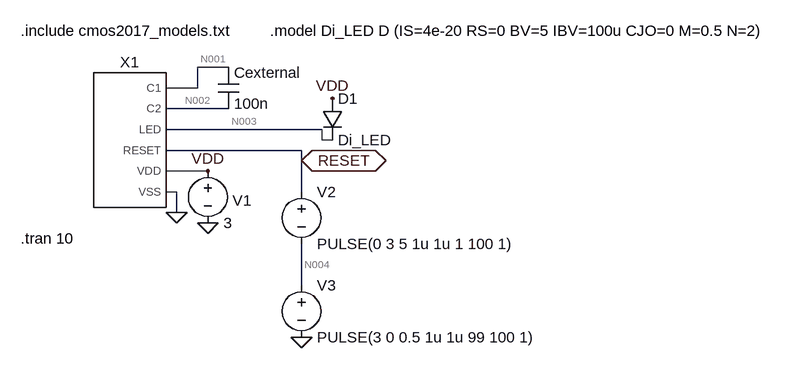
[diagram p0: schematic top.asc]
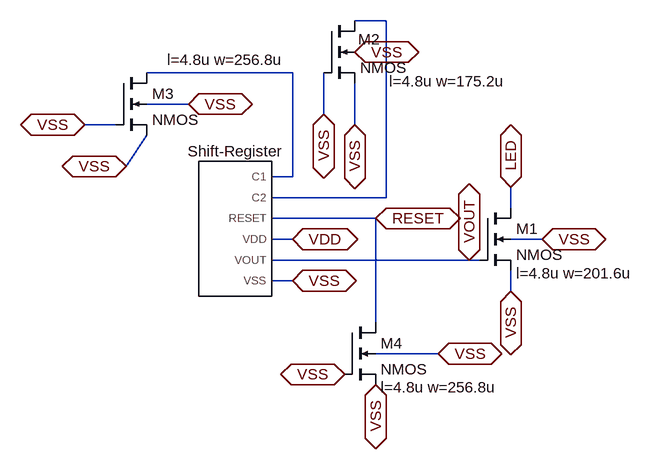
[diagram p1: sub-circuit output_driver.asc]
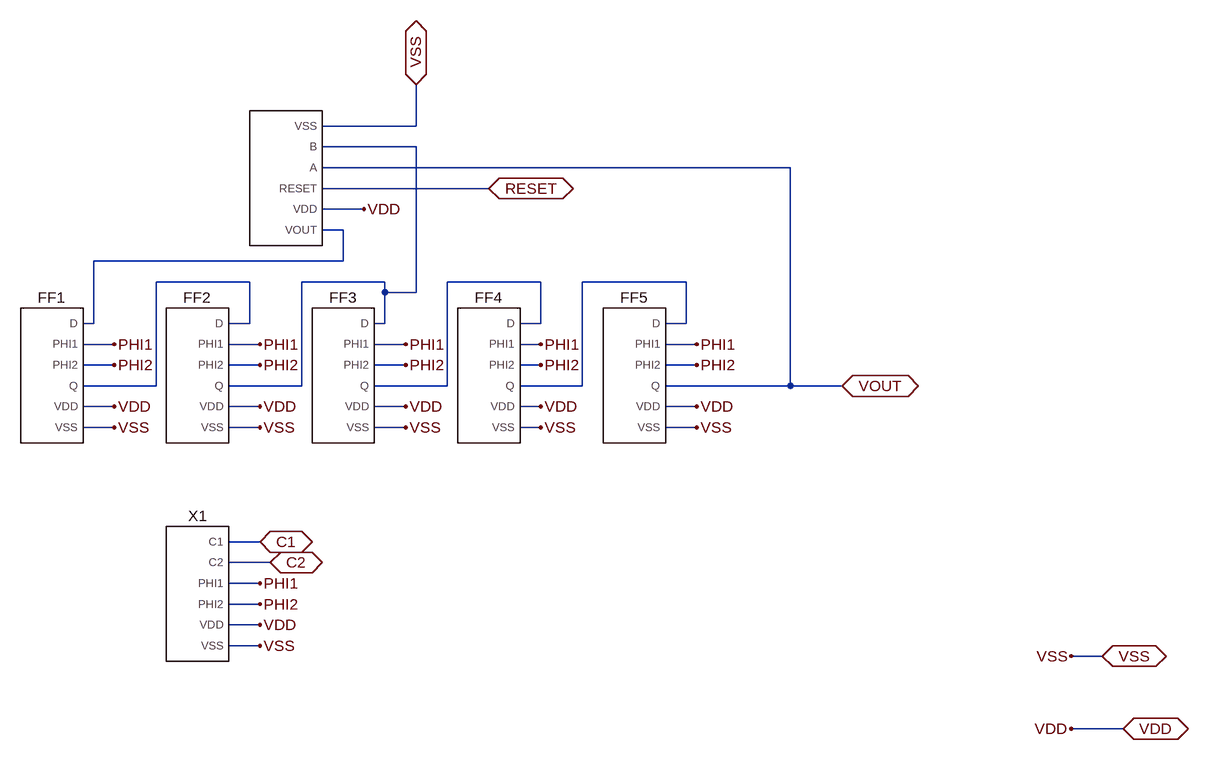
[diagram p2: sub-circuit shift_register.asc]
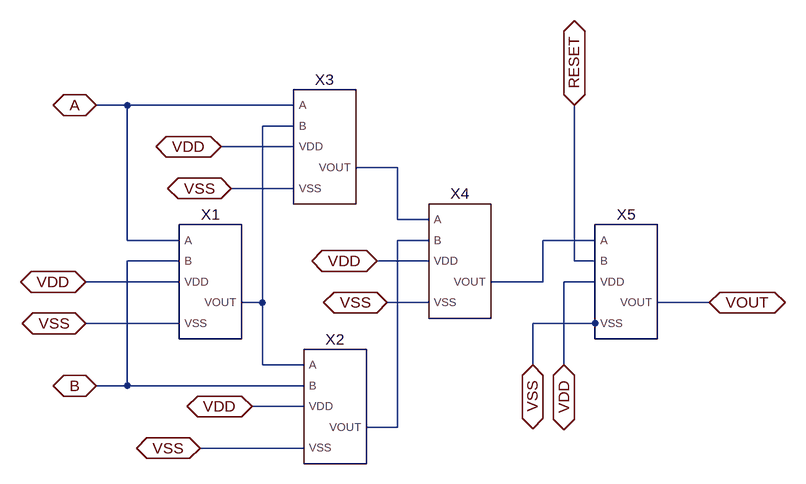
[diagram p3: sub-circuit xnor_reset.asc]
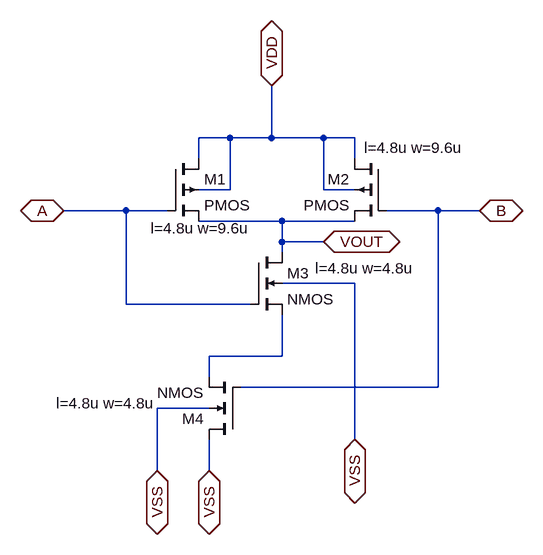
[diagram p4: sub-circuit na_nd.asc]
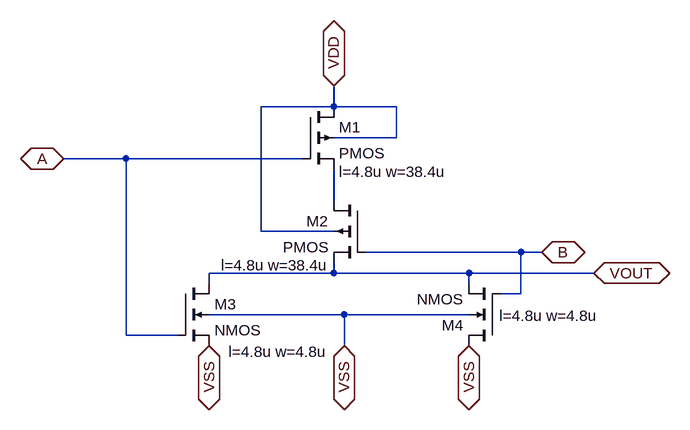
[diagram p5: sub-circuit n_or.asc]
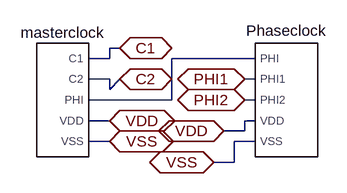
[diagram p6: sub-circuit mainclock.asc]
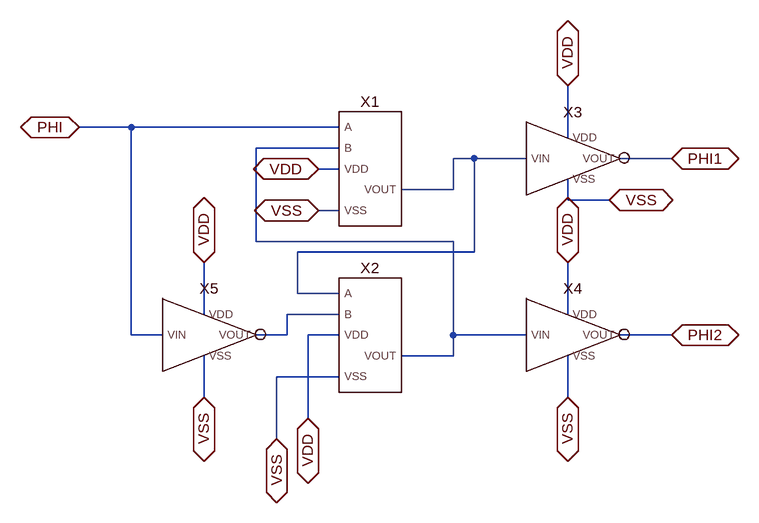
[diagram p7: sub-circuit phaseclock.asc]
top.asc, the LTspice schematic file:
Version 4
SHEET 1 1212 680
WIRE 272 64 224 64
WIRE 224 96 224 64
WIRE 224 96 176 96
WIRE 272 128 176 128
WIRE 416 160 176 160
WIRE 416 176 416 160
WIRE 432 176 416 176
WIRE 384 192 176 192
WIRE 384 208 384 192
WIRE 240 224 176 224
WIRE 192 256 176 256
WIRE 384 256 384 208
WIRE 192 288 192 256
WIRE 384 400 384 336
FLAG 192 288 0
FLAG 240 304 0
FLAG 240 224 VDD
FLAG 432 112 VDD
FLAG 384 480 0
FLAG 384 208 RESET
IOPIN 384 208 BiDir
SYMBOL output_driver 112 176 R0
SYMATTR InstName X1
SYMBOL cap 256 64 R0
SYMATTR InstName Cexternal
SYMATTR Value 100n
SYMBOL diode 416 112 R0
SYMATTR InstName D1
SYMATTR Value Di_LED
SYMBOL voltage 240 208 R0
WINDOW 0 38 61 Left 2
WINDOW 123 0 0 Left 2
WINDOW 39 0 0 Left 2
SYMATTR InstName V1
SYMATTR Value 3
SYMBOL voltage 384 240 R0
WINDOW 123 0 0 Left 2
WINDOW 39 0 0 Left 2
SYMATTR InstName V2
SYMATTR Value PULSE(0 3 5 1u 1u 1 100 1)
SYMBOL voltage 384 384 R0
WINDOW 123 0 0 Left 2
WINDOW 39 0 0 Left 2
SYMATTR InstName V3
SYMATTR Value PULSE(3 0 0.5 1u 1u 99 100 1)
TEXT 336 8 Left 2 !.model Di_LED D (IS=4e-20 RS=0 BV=5 IBV=100u CJO=0 M=0.5 N=2)
TEXT -48 8 Left 2 !.include cmos2017_models.txt
TEXT -48 328 Left 2 !.tran 10

output_driver.asc, the sub-circuit schematic file:
Version 4
SHEET 1 880 680
WIRE 352 -160 304 -160
WIRE 208 -80 -16 -80
WIRE 48 -32 -16 -32
WIRE 256 -16 256 -80
WIRE -64 0 -112 0
WIRE 304 0 304 -64
WIRE -48 64 -16 16
WIRE 208 80 208 -80
WIRE 208 80 176 80
WIRE 352 112 352 -160
WIRE 352 112 176 112
WIRE 544 128 544 96
WIRE 336 144 176 144
WIRE 208 176 176 176
WIRE 592 176 544 176
WIRE 480 208 176 208
WIRE 496 208 480 208
WIRE 208 240 176 240
WIRE 544 256 544 224
WIRE 336 304 336 144
WIRE 432 352 336 352
FLAG 336 144 RESET
IOPIN 336 144 BiDir
FLAG 208 176 VDD
IOPIN 208 176 BiDir
FLAG 208 240 VSS
IOPIN 208 240 BiDir
FLAG 544 96 LED
IOPIN 544 96 BiDir
FLAG 544 256 VSS
IOPIN 544 256 BiDir
FLAG 592 176 VSS
IOPIN 592 176 BiDir
FLAG 480 208 VOUT
IOPIN 480 208 BiDir
FLAG -48 64 VSS
IOPIN -48 64 BiDir
FLAG 48 -32 VSS
IOPIN 48 -32 BiDir
FLAG -112 0 VSS
IOPIN -112 0 BiDir
FLAG 304 0 VSS
IOPIN 304 0 BiDir
FLAG 256 -16 VSS
IOPIN 256 -16 BiDir
FLAG 304 -112 VSS
IOPIN 304 -112 BiDir
FLAG 288 384 VSS
IOPIN 288 384 BiDir
FLAG 336 400 VSS
IOPIN 336 400 BiDir
FLAG 432 352 VSS
IOPIN 432 352 BiDir
SYMBOL shift_register 112 160 R0
SYMATTR InstName Shift-Register
SYMBOL nmos4 496 128 R0
WINDOW 123 56 100 Left 2
SYMATTR InstName M1
SYMATTR Value2 l=4.8u w=201.6u
SYMBOL nmos4 256 -160 R0
WINDOW 0 53 28 Left 2
WINDOW 123 101 93 Left 2
SYMATTR InstName M2
SYMATTR Value2 l=4.8u w=175.2u
SYMBOL nmos4 -64 -80 R0
WINDOW 123 79 -20 Left 2
SYMATTR InstName M3
SYMATTR Value2 l=4.8u w=256.8u
SYMBOL nmos4 288 304 R0
WINDOW 123 56 100 Left 2
SYMATTR InstName M4
SYMATTR Value2 l=4.8u w=256.8u

shift_register.asc, the sub-circuit schematic file:
Version 4
SHEET 1 1708 832
WIRE 416 -272 416 -336
WIRE 416 -272 272 -272
WIRE 416 -240 272 -240
WIRE 992 -208 272 -208
WIRE 528 -176 272 -176
WIRE 336 -144 272 -144
WIRE 304 -112 272 -112
WIRE 304 -64 304 -112
WIRE 304 -64 -80 -64
WIRE 160 -32 16 -32
WIRE 368 -32 240 -32
WIRE 608 -32 464 -32
WIRE 832 -32 672 -32
WIRE 368 -16 368 -32
WIRE 416 -16 416 -240
WIRE 416 -16 368 -16
WIRE -80 32 -80 -64
WIRE -80 32 -96 32
WIRE 160 32 160 -32
WIRE 160 32 128 32
WIRE 368 32 368 -16
WIRE 368 32 352 32
WIRE 608 32 608 -32
WIRE 608 32 576 32
WIRE 832 32 832 -32
WIRE 832 32 800 32
WIRE -48 64 -96 64
WIRE 176 64 128 64
WIRE 400 64 352 64
WIRE 608 64 576 64
WIRE 848 64 800 64
WIRE -48 96 -96 96
WIRE 176 96 128 96
WIRE 400 96 352 96
WIRE 608 96 576 96
WIRE 848 96 800 96
WIRE 16 128 16 -32
WIRE 16 128 -96 128
WIRE 240 128 240 -32
WIRE 240 128 128 128
WIRE 464 128 464 -32
WIRE 464 128 352 128
WIRE 672 128 672 -32
WIRE 672 128 576 128
WIRE 992 128 992 -208
WIRE 992 128 800 128
WIRE 1072 128 992 128
WIRE -48 160 -96 160
WIRE 176 160 128 160
WIRE 400 160 352 160
WIRE 608 160 576 160
WIRE 848 160 800 160
WIRE -48 192 -96 192
WIRE 176 192 128 192
WIRE 400 192 352 192
WIRE 608 192 576 192
WIRE 848 192 800 192
WIRE 176 368 128 368
WIRE 192 400 128 400
WIRE 176 432 128 432
WIRE 176 464 128 464
WIRE 176 496 128 496
WIRE 176 528 128 528
WIRE 1472 544 1424 544
WIRE 1504 656 1424 656
FLAG -48 64 PHI1
FLAG 176 64 PHI1
FLAG 400 64 PHI1
FLAG 608 64 PHI1
FLAG 848 64 PHI1
FLAG 176 432 PHI1
FLAG -48 96 PHI2
FLAG 176 96 PHI2
FLAG 400 96 PHI2
FLAG 608 96 PHI2
FLAG 848 96 PHI2
FLAG 176 464 PHI2
FLAG -48 192 VSS
FLAG 176 192 VSS
FLAG 400 192 VSS
FLAG 608 192 VSS
FLAG 848 192 VSS
FLAG 176 528 VSS
FLAG -48 160 VDD
FLAG 176 160 VDD
FLAG 400 160 VDD
FLAG 608 160 VDD
FLAG 848 160 VDD
FLAG 176 496 VDD
FLAG 1504 656 VDD
IOPIN 1504 656 BiDir
FLAG 1472 544 VSS
IOPIN 1472 544 BiDir
FLAG 336 -144 VDD
FLAG 528 -176 RESET
IOPIN 528 -176 BiDir
FLAG 1072 128 VOUT
IOPIN 1072 128 BiDir
FLAG 416 -336 VSS
IOPIN 416 -336 BiDir
FLAG 1424 656 VDD
FLAG 1424 544 VSS
FLAG 176 368 C1
IOPIN 176 368 BiDir
FLAG 192 400 C2
IOPIN 192 400 BiDir
SYMBOL XNOR_reset 208 -192 R0
WINDOW 0 8 -115 Invisible 2
SYMATTR InstName XNOR
SYMBOL mainclock 80 448 R0
SYMATTR InstName X1
SYMBOL DFlipFlop -144 112 R0
SYMATTR InstName FF1
SYMBOL DFlipFlop 80 112 R0
SYMATTR InstName FF2
SYMBOL DFlipFlop 304 112 R0
SYMATTR InstName FF3
SYMBOL DFlipFlop 528 112 R0
SYMATTR InstName FF4
SYMBOL DFlipFlop 752 112 R0
SYMATTR InstName FF5

xnor_reset.asc, the sub-circuit schematic file:
Version 4
SHEET 1 880 680
WIRE -208 -224 -256 -224
WIRE 48 -224 -208 -224
WIRE 48 -192 0 -192
WIRE 48 -160 -64 -160
WIRE 208 -128 144 -128
WIRE 48 -96 -48 -96
WIRE 208 -48 208 -128
WIRE 256 -48 208 -48
WIRE -208 -16 -208 -224
WIRE -128 -16 -208 -16
WIRE 256 -16 208 -16
WIRE 512 -16 432 -16
WIRE -128 16 -208 16
WIRE 256 16 176 16
WIRE 480 16 480 -224
WIRE 512 16 480 16
WIRE -128 48 -272 48
WIRE 432 48 432 -16
WIRE 432 48 352 48
WIRE 512 48 464 48
WIRE 0 80 0 -192
WIRE 0 80 -32 80
WIRE 256 80 192 80
WIRE 688 80 608 80
WIRE -128 112 -272 112
WIRE 512 112 416 112
WIRE 512 128 512 112
WIRE 0 176 0 80
WIRE 64 176 0 176
WIRE 416 176 416 112
WIRE 464 176 464 48
WIRE -208 208 -208 16
WIRE -208 208 -256 208
WIRE 64 208 -208 208
WIRE 64 240 -16 240
WIRE 208 272 208 -16
WIRE 208 272 160 272
WIRE 64 304 -96 304
FLAG -256 -224 A
IOPIN -256 -224 BiDir
FLAG -256 208 B
IOPIN -256 208 BiDir
FLAG -272 112 VSS
IOPIN -272 112 BiDir
FLAG -272 48 VDD
IOPIN -272 48 BiDir
FLAG -64 -160 VDD
IOPIN -64 -160 BiDir
FLAG -48 -96 VSS
IOPIN -48 -96 BiDir
FLAG -96 304 VSS
IOPIN -96 304 BiDir
FLAG -16 240 VDD
IOPIN -16 240 BiDir
FLAG 688 80 VOUT
IOPIN 688 80 BiDir
FLAG 464 176 VDD
IOPIN 464 176 BiDir
FLAG 416 176 VSS
IOPIN 416 176 BiDir
FLAG 480 -224 RESET
IOPIN 480 -224 BiDir
FLAG 176 16 VDD
IOPIN 176 16 BiDir
FLAG 192 80 VSS
IOPIN 192 80 BiDir
SYMBOL NA_ND -80 48 M0
SYMATTR InstName X1
SYMBOL NA_ND 112 240 M0
SYMATTR InstName X2
SYMBOL NA_ND 96 -160 M0
SYMATTR InstName X3
SYMBOL NA_ND 304 16 M0
SYMATTR InstName X4
SYMBOL N_OR 560 48 R0
SYMATTR InstName X5

na_nd.asc, the sub-circuit schematic file:
Version 4
SHEET 1 880 680
WIRE 96 16 48 16
WIRE 160 16 160 -64
WIRE 160 16 96 16
WIRE 240 16 160 16
WIRE 288 16 240 16
WIRE 48 48 48 16
WIRE 288 48 288 16
WIRE 96 96 96 16
WIRE 96 96 48 96
WIRE 240 96 240 16
WIRE 288 96 240 96
WIRE -64 128 -160 128
WIRE 0 128 -64 128
WIRE 416 128 336 128
WIRE 480 128 416 128
WIRE 176 144 48 144
WIRE 288 144 176 144
WIRE 176 176 176 144
WIRE 240 176 176 176
WIRE 176 192 176 176
WIRE 288 240 176 240
WIRE -64 272 -64 128
WIRE 128 272 -64 272
WIRE 176 352 176 288
WIRE 176 352 64 352
WIRE 64 384 64 352
WIRE 416 400 416 128
WIRE 416 400 112 400
WIRE 64 432 -16 432
WIRE 288 480 288 240
WIRE -16 528 -16 432
WIRE 64 528 64 480
FLAG 240 176 VOUT
IOPIN 240 176 BiDir
FLAG 480 128 B
IOPIN 480 128 BiDir
FLAG 160 -64 VDD
IOPIN 160 -64 BiDir
FLAG -160 128 A
IOPIN -160 128 BiDir
FLAG -16 528 VSS
IOPIN -16 528 BiDir
FLAG 64 528 VSS
IOPIN 64 528 BiDir
FLAG 288 480 VSS
IOPIN 288 480 BiDir
SYMBOL pmos4 0 48 R0
WINDOW 123 -26 107 Left 2
SYMATTR Value2 l=4.8u w=9.6u
SYMATTR InstName M1
SYMBOL pmos4 336 48 M0
WINDOW 123 -119 -17 Left 2
SYMATTR Value2 l=4.8u w=9.6u
SYMATTR InstName M2
SYMBOL nmos4 128 192 R0
WINDOW 123 99 25 Left 2
SYMATTR Value2 l=4.8u w=4.8u
SYMATTR InstName M3
SYMBOL nmos4 112 480 R180
WINDOW 123 131 56 Left 2
SYMATTR Value2 l=4.8u w=4.8u
SYMATTR InstName M4

n_or.asc, the sub-circuit schematic file:
Version 4
SHEET 1 880 680
WIRE 192 48 192 16
WIRE 192 48 80 48
WIRE 288 48 192 48
WIRE 288 96 288 48
WIRE 288 96 192 96
WIRE -128 128 -224 128
WIRE 144 128 -128 128
WIRE 192 192 192 144
WIRE 80 240 80 48
WIRE 192 240 80 240
WIRE 480 272 240 272
WIRE 512 272 480 272
WIRE 192 304 192 288
WIRE 192 304 0 304
WIRE 400 304 192 304
WIRE 592 304 400 304
WIRE 0 320 0 304
WIRE 400 320 400 304
WIRE 480 336 480 272
WIRE 480 336 448 336
WIRE 208 368 0 368
WIRE 400 368 208 368
WIRE -128 400 -128 128
WIRE -48 400 -128 400
WIRE 208 416 208 368
FLAG 512 272 B
IOPIN 512 272 BiDir
FLAG 192 16 VDD
IOPIN 192 16 BiDir
FLAG 592 304 VOUT
IOPIN 592 304 BiDir
FLAG -224 128 A
IOPIN -224 128 BiDir
FLAG 0 416 VSS
IOPIN 0 416 BiDir
FLAG 208 416 VSS
IOPIN 208 416 BiDir
FLAG 400 416 VSS
IOPIN 400 416 BiDir
SYMBOL pmos4 144 48 R0
WINDOW 123 56 100 Left 2
SYMATTR Value2 l=4.8u w=38.4u
SYMATTR InstName M1
SYMBOL pmos4 240 192 M0
WINDOW 123 56 100 Left 2
SYMATTR Value2 l=4.8u w=38.4u
SYMATTR InstName M2
SYMBOL nmos4 -48 320 R0
WINDOW 123 78 105 Left 2
SYMATTR Value2 l=4.8u w=4.8u
SYMATTR InstName M3
SYMBOL nmos4 448 416 R180
WINDOW 123 -151 46 Left 2
SYMATTR Value2 l=4.8u w=4.8u
SYMATTR InstName M4

mainclock.asc, the sub-circuit schematic file:
Version 4
SHEET 1 880 680
WIRE -288 272 -304 272
WIRE -304 288 -304 272
WIRE -304 288 -336 288
WIRE -80 288 -208 288
WIRE -304 320 -336 320
WIRE -80 320 -96 320
WIRE -304 336 -304 320
WIRE -304 336 -288 320
WIRE -208 352 -208 288
WIRE -208 352 -336 352
WIRE -80 352 -96 352
WIRE -304 384 -336 384
WIRE -80 384 -96 384
WIRE -96 400 -96 384
WIRE -96 400 -128 400
WIRE -304 416 -336 416
WIRE -80 416 -112 416
WIRE -112 448 -112 416
WIRE -112 448 -144 448
FLAG -304 384 VDD
IOPIN -304 384 BiDir
FLAG -304 416 VSS
IOPIN -304 416 BiDir
FLAG -128 400 VDD
IOPIN -128 400 BiDir
FLAG -144 448 VSS
IOPIN -144 448 BiDir
FLAG -96 320 PHI1
IOPIN -96 320 BiDir
FLAG -96 352 PHI2
IOPIN -96 352 BiDir
FLAG -288 272 C1
IOPIN -288 272 BiDir
FLAG -288 320 C2
IOPIN -288 320 BiDir
SYMBOL phaseclock -32 352 M0
WINDOW 0 0 -91 Bottom 2
SYMATTR InstName Phaseclock
SYMBOL masterclock_generator -384 352 R0
SYMATTR InstName masterclock

phaseclock.asc, the sub-circuit schematic file:
Version 4
SHEET 1 1016 680
WIRE -352 -160 -432 -160
WIRE -32 -160 -352 -160
WIRE 320 -144 320 -224
WIRE -32 -128 -160 -128
WIRE 176 -112 144 -112
WIRE 256 -112 176 -112
WIRE 480 -112 400 -112
WIRE -32 -96 -64 -96
WIRE 144 -64 144 -112
WIRE 144 -64 64 -64
WIRE 320 -48 320 -80
WIRE 384 -48 320 -48
WIRE -32 -32 -64 -32
WIRE -160 16 -160 -128
WIRE 144 16 -160 16
WIRE 176 32 176 -112
WIRE 176 32 -96 32
WIRE -96 96 -96 32
WIRE -32 96 -96 96
WIRE -240 128 -240 48
WIRE -32 128 -112 128
WIRE 320 128 320 48
WIRE -352 160 -352 -160
WIRE -304 160 -352 160
WIRE -112 160 -112 128
WIRE -112 160 -160 160
WIRE -32 160 -80 160
WIRE 144 160 144 16
WIRE 256 160 144 160
WIRE 480 160 400 160
WIRE 144 192 144 160
WIRE 144 192 64 192
WIRE -32 224 -128 224
WIRE -240 256 -240 192
WIRE 320 256 320 192
WIRE -80 288 -80 160
WIRE -128 320 -128 224
FLAG -432 -160 PHI
IOPIN -432 -160 BiDir
FLAG -240 48 VDD
IOPIN -240 48 BiDir
FLAG -64 -96 VDD
IOPIN -64 -96 BiDir
FLAG 320 -224 VDD
IOPIN 320 -224 BiDir
FLAG 320 48 VDD
IOPIN 320 48 BiDir
FLAG -80 288 VDD
IOPIN -80 288 BiDir
FLAG -64 -32 VSS
IOPIN -64 -32 BiDir
FLAG -128 320 VSS
IOPIN -128 320 BiDir
FLAG -240 256 VSS
IOPIN -240 256 BiDir
FLAG 320 256 VSS
IOPIN 320 256 BiDir
FLAG 384 -48 VSS
IOPIN 384 -48 BiDir
FLAG 480 -112 PHI1
IOPIN 480 -112 BiDir
FLAG 480 160 PHI2
IOPIN 480 160 BiDir
SYMBOL NA_ND 16 -96 M0
SYMATTR InstName X1
SYMBOL NA_ND 16 160 M0
SYMATTR InstName X2
SYMBOL Inverter 320 -112 R0
SYMATTR InstName X3
SYMBOL Inverter 320 160 R0
SYMATTR InstName X4
SYMBOL Inverter -240 160 R0
SYMATTR InstName X5

inverter.asc, the sub-circuit schematic file:
Version 4
SHEET 1 880 680
WIRE 240 0 240 -48
WIRE 304 0 240 0
WIRE 240 16 240 0
WIRE 304 64 304 0
WIRE 304 64 240 64
WIRE 192 96 128 96
WIRE 240 144 240 112
WIRE 320 144 240 144
WIRE 128 160 128 96
WIRE 128 160 64 160
WIRE 240 160 240 144
WIRE 320 208 240 208
WIRE 128 240 128 160
WIRE 192 240 128 240
WIRE 240 304 240 256
WIRE 320 304 320 208
WIRE 320 304 240 304
WIRE 240 384 240 304
FLAG 64 160 VIN
IOPIN 64 160 BiDir
FLAG 320 144 VOUT
IOPIN 320 144 BiDir
FLAG 240 -48 VDD
IOPIN 240 -48 BiDir
FLAG 240 384 VSS
IOPIN 240 384 BiDir
SYMBOL pmos4 192 16 R0
WINDOW 123 56 100 Left 2
SYMATTR Value2 l=4.8u w=9.6u
SYMATTR InstName M1
SYMBOL nmos4 192 160 R0
WINDOW 123 56 100 Left 2
SYMATTR Value2 l=4.8u w=4.8u
SYMATTR InstName M2

masterclock_generator.asc, the sub-circuit schematic file:
Version 4
SHEET 1 984 680
WIRE -496 64 -496 0
WIRE -112 80 -112 16
WIRE 304 80 304 16
WIRE 704 80 704 0
WIRE -624 96 -624 -144
WIRE -560 96 -624 96
WIRE -224 96 -416 96
WIRE -224 112 -224 96
WIRE -176 112 -224 112
WIRE 96 112 96 -144
WIRE 96 112 -32 112
WIRE 240 112 96 112
WIRE 576 112 384 112
WIRE 640 112 576 112
WIRE 880 112 784 112
WIRE -496 176 -496 128
WIRE -112 192 -112 144
WIRE 304 192 304 144
WIRE 704 192 704 144
WIRE -624 416 -624 96
WIRE -32 416 -624 416
WIRE 16 416 16 336
WIRE 576 416 576 112
WIRE 576 416 64 416
WIRE 48 528 48 464
FLAG 880 112 PHI
IOPIN 880 112 BiDir
FLAG 96 -144 C2
IOPIN 96 -144 BiDir
FLAG -624 -144 C1
IOPIN -624 -144 BiDir
FLAG -496 0 VDD
IOPIN -496 0 BiDir
FLAG -112 16 VDD
IOPIN -112 16 BiDir
FLAG 304 16 VDD
IOPIN 304 16 BiDir
FLAG 704 0 VDD
IOPIN 704 0 BiDir
FLAG -496 176 VSS
IOPIN -496 176 BiDir
FLAG -112 192 VSS
IOPIN -112 192 BiDir
FLAG 304 192 VSS
IOPIN 304 192 BiDir
FLAG 704 192 VSS
IOPIN 704 192 BiDir
FLAG 48 528 VDD
IOPIN 48 528 BiDir
FLAG 16 336 VSS
IOPIN 16 336 BiDir
SYMBOL Inverter -496 96 R0
SYMATTR InstName X1
SYMBOL Inverter -112 112 R0
SYMATTR InstName X2
SYMBOL Inverter 304 112 R0
SYMATTR InstName X3
SYMBOL Inverter 704 112 R0
SYMATTR InstName X4
SYMBOL nmos4 -32 464 R270
WINDOW 123 65 0 Left 2
SYMATTR InstName M1
SYMATTR Value2 l=96u w=4.8u

dflipflop.asc, the sub-circuit schematic file:
Version 4
SHEET 1 880 680
WIRE 128 16 128 0
WIRE 192 16 128 16
WIRE 448 16 448 -32
WIRE 528 16 448 16
WIRE 192 64 192 16
WIRE 192 64 128 64
WIRE 528 64 528 16
WIRE 528 64 448 64
WIRE 80 96 48 96
WIRE 400 96 384 96
WIRE -96 144 -144 144
WIRE -48 144 -48 64
WIRE 48 144 48 96
WIRE 48 144 0 144
WIRE 128 144 128 112
WIRE 256 144 128 144
WIRE 304 144 304 80
WIRE 352 144 336 144
WIRE 384 144 384 96
WIRE 384 144 352 144
WIRE 448 144 448 112
WIRE 576 144 448 144
WIRE 128 160 128 144
WIRE 448 160 448 144
WIRE -16 208 -16 192
WIRE 208 208 128 208
WIRE 336 208 336 192
WIRE 528 208 448 208
WIRE 48 240 48 144
WIRE 80 240 48 240
WIRE 384 240 384 144
WIRE 400 240 384 240
WIRE 208 256 208 208
WIRE 208 256 128 256
WIRE 528 256 528 208
WIRE 528 256 448 256
WIRE 128 288 128 256
WIRE 448 288 448 256
FLAG 128 0 VDD
IOPIN 128 0 BiDir
FLAG 448 -32 VDD
IOPIN 448 -32 BiDir
FLAG 336 208 PHI2
IOPIN 336 208 BiDir
FLAG -16 208 PHI1
IOPIN -16 208 BiDir
FLAG 576 144 Q
IOPIN 576 144 BiDir
FLAG -144 144 D
IOPIN -144 144 BiDir
FLAG -48 64 VSS
IOPIN -48 64 BiDir
FLAG 304 80 VSS
IOPIN 304 80 BiDir
FLAG 448 288 VSS
IOPIN 448 288 BiDir
FLAG 128 288 VSS
IOPIN 128 288 BiDir
SYMBOL nmos4 80 160 R0
WINDOW 123 56 116 Left 2
SYMATTR Value2 l=4.8u w=4.8u
SYMATTR InstName M1
SYMBOL pmos4 80 16 R0
WINDOW 123 -23 -4 Left 2
SYMATTR Value2 l=4.8u w=9.6u
SYMATTR InstName M2
SYMBOL nmos4 400 160 R0
WINDOW 123 58 109 Left 2
SYMATTR Value2 l=4.8u w=4.8u
SYMATTR InstName M3
SYMBOL pmos4 400 16 R0
WINDOW 123 56 100 Left 2
SYMATTR Value2 l=4.8u w=9.6u
SYMATTR InstName M4
SYMBOL nmos4 -96 192 R270
WINDOW 123 60 -2 Left 2
SYMATTR Value2 l=19.2u w=9.6u
SYMATTR InstName M5
SYMBOL nmos4 256 192 R270
WINDOW 123 58 10 Left 2
SYMATTR Value2 l=19.2u w=9.6u
SYMATTR InstName M6

The netlist it stands for:
* top.asc
XX1 N001 N002 N003 RESET VDD 0 output_driver
Cexternal N001 N002 100n
D1 VDD N003 Di_LED
V1 VDD 0 3
V2 RESET N004 PULSE(0 3 5 1u 1u 1 100 1)
V3 N004 0 PULSE(3 0 0.5 1u 1u 99 100 1)

* block symbol definitions
.subckt output_driver C1 C2 LED RESET VDD VSS
XShift-Register N002 N001 RESET VDD VOUT VSS shift_register
M1 LED VOUT VSS VSS NMOS l=4.8u w=201.6u
M2 N001 VSS VSS VSS NMOS l=4.8u w=175.2u
M3 N002 VSS VSS VSS NMOS l=4.8u w=256.8u
M4 RESET VSS VSS VSS NMOS l=4.8u w=256.8u
.ends output_driver

.subckt shift_register C1 C2 RESET VDD VOUT VSS
XXNOR VOUT N001 RESET VDD N002 VSS xnor_reset
XX1 C1 C2 PHI1 PHI2 VDD VSS mainclock
XFF1 N002 PHI1 PHI2 N003 VDD VSS dflipflop
XFF2 N003 PHI1 PHI2 N001 VDD VSS dflipflop
XFF3 N001 PHI1 PHI2 N004 VDD VSS dflipflop
XFF4 N004 PHI1 PHI2 N005 VDD VSS dflipflop
XFF5 N005 PHI1 PHI2 VOUT VDD VSS dflipflop
.ends shift_register

.subckt xnor_reset A B RESET VDD VOUT VSS
XX1 A B VDD N001 VSS na_nd
XX2 N001 B VDD N003 VSS na_nd
XX3 A N001 VDD N002 VSS na_nd
XX4 N002 N003 VDD N004 VSS na_nd
XX5 N004 RESET VDD VOUT VSS n_or
.ends xnor_reset

.subckt na_nd A B VDD VOUT VSS
M1 VDD A VOUT VDD PMOS l=4.8u w=9.6u
M2 VDD B VOUT VDD PMOS l=4.8u w=9.6u
M3 VOUT A N001 VSS NMOS l=4.8u w=4.8u
M4 VSS B N001 VSS NMOS l=4.8u w=4.8u
.ends na_nd

.subckt n_or A B VDD VOUT VSS
M1 VDD A N001 VDD PMOS l=4.8u w=38.4u
M2 N001 B VOUT VDD PMOS l=4.8u w=38.4u
M3 VOUT A VSS VSS NMOS l=4.8u w=4.8u
M4 VSS B VOUT VSS NMOS l=4.8u w=4.8u
.ends n_or

.subckt mainclock C1 C2 PHI1 PHI2 VDD VSS
XPhaseclock N001 PHI1 PHI2 VDD VSS phaseclock
Xmasterclock C1 C2 N001 VDD VSS masterclock_generator
.ends mainclock

.subckt phaseclock PHI PHI1 PHI2 VDD VSS
XX1 PHI N001 VDD N002 VSS na_nd
XX2 N002 N003 VDD N001 VSS na_nd
XX3 VDD N002 VSS PHI1 inverter
XX4 VDD N001 VSS PHI2 inverter
XX5 VDD PHI VSS N003 inverter
.ends phaseclock

.subckt inverter VDD VIN VSS VOUT
M1 VDD VIN VOUT VDD PMOS l=4.8u w=9.6u
M2 VOUT VIN VSS VSS NMOS l=4.8u w=4.8u
.ends inverter

.subckt masterclock_generator C1 C2 PHI VDD VSS
XX1 VDD C1 VSS N001 inverter
XX2 VDD N001 VSS C2 inverter
XX3 VDD C2 VSS N002 inverter
XX4 VDD N002 VSS PHI inverter
M1 C1 VDD N002 VSS NMOS l=96u w=4.8u
.ends masterclock_generator

.subckt dflipflop D PHI1 PHI2 Q VDD VSS
M1 N003 N001 VSS VSS NMOS l=4.8u w=4.8u
M2 VDD N001 N003 VDD PMOS l=4.8u w=9.6u
M3 Q N002 VSS VSS NMOS l=4.8u w=4.8u
M4 VDD N002 Q VDD PMOS l=4.8u w=9.6u
M5 D PHI1 N001 VSS NMOS l=19.2u w=9.6u
M6 N003 PHI2 N002 VSS NMOS l=19.2u w=9.6u
.ends dflipflop

.model D D
.lib standard.dio
.model NMOS NMOS
.model PMOS PMOS
.lib standard.mos
.model Di_LED D (IS=4e-20 RS=0 BV=5 IBV=100u CJO=0 M=0.5 N=2)
.include cmos2017_models.txt
.tran 10
.backanno
.end

* Results of the author's LTspice run, read from the files saved beside the schematic
* Operating Point, zero values left out:
*   V(vdd) = 3 V
*   V(reset) = 3 V
*   V(n001) = 1.481 V
*   V(n002) = 1.481 V
*   V(n003) = 1.859 V
*   V(n004) = 3 V
*   I(D1) = 152.5 pA
*   I(V1) = -583.7 µA
*   Ix(x1:LED) = 152.5 pA
*   Ix(x1:VDD) = 583.7 µA
*   Ix(x1:VSS) = -517.4 µA